# Altium schematic sheet JTAG_Configuration.SchDoc: Metlino
size 420 x 297 mm; CheckedBy: P.Kulik,T.Przywozki,W.Ruclo; Author: G.Kasprowicz; CompanyName: WUT ISE; DrawnBy: G.Kasprowicz; Organization: WUT ISE; Address1: PW ISE; Address2: Nowowiejska 15/19 00-665 Warsaw; Address3: gkasprow@gmail.com; DocumentNumber: 19; Revision: 2; SheetNumber: 19; SheetTotal: 29; ModifiedBy: -; CheckedDate: -; Title2: JTAG; DivGrp: WUT ISE; Designer: G.Kasprowicz; ModifiedDate: -; ProjectName: Sensor Box
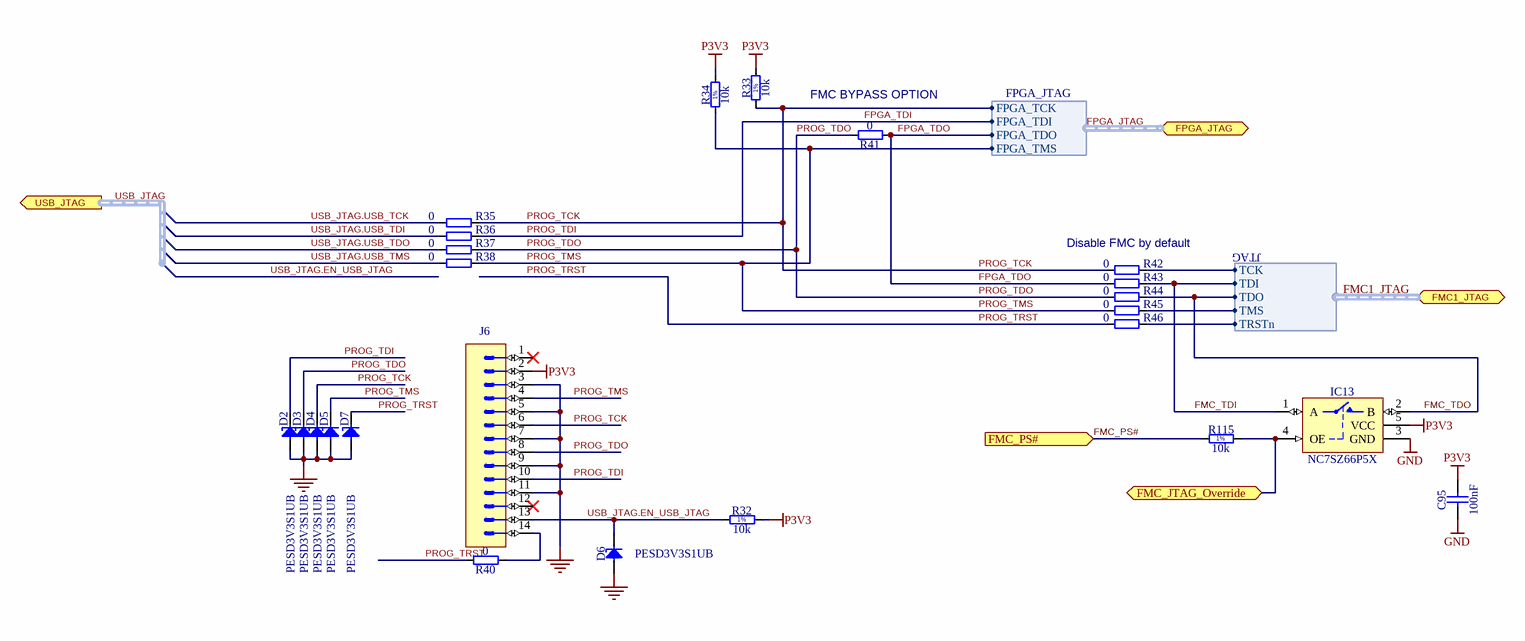
[diagram p0: JTAG_Configuration.SchDoc]

## Parts
C95  100nF  [CAPC0603X33N]
D2  PESD3V3S1UB  [SODFL1608X65N]
D3  PESD3V3S1UB  [SODFL1608X65N]
D4  PESD3V3S1UB  [SODFL1608X65N]
D5  PESD3V3S1UB  [SODFL1608X65N]
D6  PESD3V3S1UB  [SODFL1608X65N]
D7  PESD3V3S1UB  [SODFL1608X65N]
IC13  NC7SZ66P5X  [SOT65P210X110-5N]
J6  Milli-Grid™  [MOLEX_87832-1420]  (value not drawn)
R32  10k  [RESC1005X40N]
R33  10k  [RESC1005X40N]
R34  10k  [RESC1005X40N]
R35  0  [RESC1005X40N]
R36  0  [RESC1005X40N]
R37  0  [RESC1005X40N]
R38  0  [RESC1005X40N]
R40  0  [RESC1005X40N]
R41  0  [RESC1005X40N]
R42  0  [RESC1005X40N]
R43  0  [RESC1005X40N]
R44  0  [RESC1005X40N]
R45  0  [RESC1005X40N]
R46  0  [RESC1005X40N]
R115  10k  [RESC1005X40N]

## Ports
FMC1_JTAG (bidir, harness JTAG), FMC_JTAG_Override (bidir), FMC_PS# (in), FPGA_JTAG (bidir, harness FPGA_JTAG), USB_JTAG (out, harness USB_JTAG)

## Harnesses
JTAG: TCK, TDI, TDO, TMS, TRSTn
FPGA_JTAG: FPGA_TCK, FPGA_TDI, FPGA_TDO, FPGA_TMS

## Nets
GND: C95.1 D2.2(A) D3.2(A) D4.2(A) D5.2(A) D6.2(A) D7.2(A) IC13.3(GND) J6.3 J6.5 J6.7 J6.9 J6.11
P3V3: C95.2 IC13.5(VCC) J6.2 R32.2 R33.2 R34.2
FMC1_JTAG.TCK: R42.1 ; port FMC1_JTAG.TCK
FMC1_JTAG.TMS: R45.1 ; port FMC1_JTAG.TMS
FMC1_JTAG.TRSTn: R46.1 ; port FMC1_JTAG.TRSTn
FMC_JTAG_Override: IC13.4(OE) R115.2 ; port FMC_JTAG_Override
FMC_PS#: R115.1 ; port FMC_PS#
FMC_TDI: IC13.1(A) R43.1 ; port FMC1_JTAG.TDI  [project net FMC1_JTAG.TDI]
FMC_TDO: IC13.2(B) R44.1 ; port FMC1_JTAG.TDO  [project net FMC1_JTAG.TDO]
FPGA_TDI: D2.1(C) J6.10 R36.1 ; port FPGA_JTAG.FPGA_TDI  [also labelled PROG_TDI]  [project net FPGA_JTAG.FPGA_TDI]
FPGA_TDO: R41.1 R43.2 ; port FPGA_JTAG.FPGA_TDO  [project net FPGA_JTAG.FPGA_TDO]
PROG_TCK: D4.1(C) J6.6 R33.1 R35.1 R42.2 ; port FPGA_JTAG.FPGA_TCK  [project net FPGA_JTAG.FPGA_TCK]
PROG_TDO: D3.1(C) J6.8 R37.1 R41.2 R44.2
PROG_TMS: D5.1(C) J6.4 R34.1 R38.1 R45.2 ; port FPGA_JTAG.FPGA_TMS  [project net FPGA_JTAG.FPGA_TMS]
PROG_TRST: D7.1(C) R40.2 R46.2
USB_JTAG.EN_USB_JTAG: D6.1(C) J6.13 R32.1
USB_JTAG.USB_TCK: R35.2
USB_JTAG.USB_TDI: R36.2
USB_JTAG.USB_TDO: R37.2
USB_JTAG.USB_TMS: R38.2
NetJ6_14: J6.14 R40.1

Not connected (* = marked no-connect by the designer): J6 1* 12*

## Buses and harness runs
harness FMC1_JTAG = port FMC1_JTAG
harness FPGA_JTAG = port FPGA_JTAG
harness USB_JTAG = port USB_JTAG

## Notes on the sheet
- FMC BYPASS OPTION
- Disable FMC by default
- Project/Equipment
- Document
- Designer
- Drawn by
- Check.by
- Copyright WUT ISE 2018.
  This documentation describes Open Hardware and is licensed under the CERN OHL v.1.1. You may redistribute and modify this documentation under the terms of the CERN OHL v.1.1. (http://ohwr.org/CERNOHL). This documentation is distributed WITHOUT ANY EXPRESS OR IMPLIED WARRANTY, INCLUDING OF MERCHANTABILITY, SATISFACTORY QUALITY AND FITNESS FOR A PARTICULAR PURPOSE. Please see the CERN OHL v.1.1 for applicable conditions.
- Contact
- File
- Last Mod.
- Print Date
- Sheet
- Size
- A3
- of
- Rev
- (in symbol R0402_10K_1%_0.0625W_100PPM) 1%

## Library data of the parts
C95 = CC0201_100NF_6.3V_10%_X5R: Non-polarised capacitor; Manufacturer: GENERIC; Manufacturer1 Part Number: 02016D104KAT2A; Part Description: SMD Multilayer Chip Ceramic Capacitor; TC: X5R; Tolerance: ±10%; Voltage: 6.3V; Author: CERN DEM JLC; Case: 0201; Component Kind: Standard; Component Type: Standard; CreateDate: 03.12.2007; HelpURL: \\cern.ch\dfs\Applications\Altium\Datasheets\CC0201_X5R_AVX.pdf; LatestRevisionDate: 03.12.2007; Manufacturer Part Number: CC0201_100NF_6.3V_10%_X5R; Manufacturer1 ComponentHeight: 0.33mm; Manufacturer1 Example: AVX; Mounted: Yes; Part Number: CC0201_100NF_6.3V_10%_X5R; Pin Count: 2; SMD: Yes; Socket: No; Status: Not Recommended; Value: 100nF; Sense: No
D2-D7 = PESD3V3S1UB: ESD protection diode; Manufacturer: NXP SEMICONDUCTORS; Part Description: ESD protection diode (23kV); Voltage: 3V3; Power: 330W; PressFit: No; Bonding: No; Manufacturer Part Number: PESD3V3S1UB; PackageDescription: Ultra Small Outline Diode Flat Lead (SOD-523), Body; 1.2mm L X 0.8mm W X 0.65mm H, IPC Medium Density; Part Number: PESD3V3S1UB; Component Kind: Standard; Component Type: Standard; Device: PESD3V3S1UB; Pin Count: 2; Case: SOD523; Mounted: Yes; Socket: No; SMD: Yes; Sense: No; ComponentHeight: 0.65mm; HelpURL: \\cern.ch\dfs\Applications\Altium\Datasheets\PESD3V3S1UB.pdf; Author: CERN DEM JLC; CreateDate: 29.11.2012; LatestRevisionDate: 29.11.2012
IC13 = NC7SZ66P5X: TinyLogic® Low Voltage Single SPST Normally Open Bus Switch; Manufacturer: FAIRCHILD SEMICONDUCTOR; PressFit: No; Bonding: No; Part Number: NC7SZ66P5X; Component Kind: Standard; Component Type: Standard; Device: NC7SZ66P5X; PackageDescription: SOT353, SC70-5, SOT, 0.65mm Pitch, 5 pin, 1.25mm W X 2.00mm L X 1.10mm H, IPC Medium Density; Part Description: Low Voltage Single SPST Normally Open Bus Switch; Manufacturer Part Number: NC7SZ66P5X; Pin Count: 5; Case: SOT353; Mounted: Yes; Socket: No; SMD: Yes; Sense: No; ComponentHeight: 1.1mm; Author: CERN DEM JLC; HelpURL: \\cern.ch\dfs\Applications\Altium\Datasheets\NC7SZ66P5X.pdf; CreateDate: 07.07.2014; LatestRevisionDate: 07.07.2014
J6 = MOLEX_87832-1420: Connector 14 Male; Manufacturer: MOLEX; Part Description: 2.00mm (.079") Pitch Milli-Grid™ Header, Surface Mount, Vertical, Shrouded, 14 Circuits,with Locking Windows and Centre Polarization Slot, PCB Locator; PressFit: No; Manufacturer Part Number: 87832-1420; Part Number: MOLEX_87832-1420; Component Kind: Standard; Component Type: Standard; Pin Count: 14; Family: Milli-Grid™; Mounted: Yes; Socket: No; SMD: Yes; Sense: No; Status: None; ComponentHeight: 7.6mm; HelpURL: \\cern.ch\dfs\Applications\Altium\Datasheets\MOLEX_87832-1420.pdf; Author: CERN DEM JLC; CreateDate: 09.09.2008; LatestRevisionDate: 09.09.2008
R32-R34 R115 = R0402_10K_1%_0.0625W_100PPM: Resistor - 1%; Manufacturer: GENERIC; Part Description: General Purpose Thick Film Chip Resistor; Manufacturer1 Part Number: 232270671003L; TC: ±100ppm/°C; PressFit: No; Manufacturer Part Number: R0402_10K_1%_0.0625W_100PPM; Part Number: R0402_10K_1%_0.0625W_100PPM; Tolerance: ±1%; Value: 10k; Component Kind: Standard; Component Type: Standard; Pin Count: 2; Status: Not Recommended; Power: 0.0625W; Case: 0402; Mounted: Yes; Sense: No; Socket: No; SMD: Yes; Manufacturer1 Example: YAGEO PHYCOMP; Manufacturer1 ComponentHeight: 0.4mm; HelpURL: \\cern.ch\dfs\Applications\Altium\Datasheets\R0402_Phycomp_RC0402.pdf; Author: CERN DEM JLC; CreateDate: 03.12.2007; LatestRevisionDate: 17.10.2012
R35-R38 R40-R46 = R0402_0R_JUMPER: Resistor; Manufacturer: GENERIC; Part Description: 1A (0.05R Max DC Resistance) Zero Ohm Jumper; Manufacturer1 Part Number: 232270591001L; PressFit: No; Manufacturer Part Number: R0402_0R_JUMPER; Part Number: R0402_0R_JUMPER; Value: 0; Component Kind: Standard; Component Type: Standard; Pin Count: 2; Status: Not Recommended; Case: 0402; Mounted: Yes; Sense: No; Socket: No; SMD: Yes; Manufacturer1 Example: YAGEO PHYCOMP; Manufacturer1 ComponentHeight: 0.4mm; HelpURL: \\cern.ch\dfs\Applications\Altium\Datasheets\R0402_Phycomp_RC0402.pdf; Author: CERN DEM JLC; CreateDate: 03.12.2007; LatestRevisionDate: 17.10.2012